# EAGLE design FDC_Board_DualSlim (EAGLE 7.5.0)
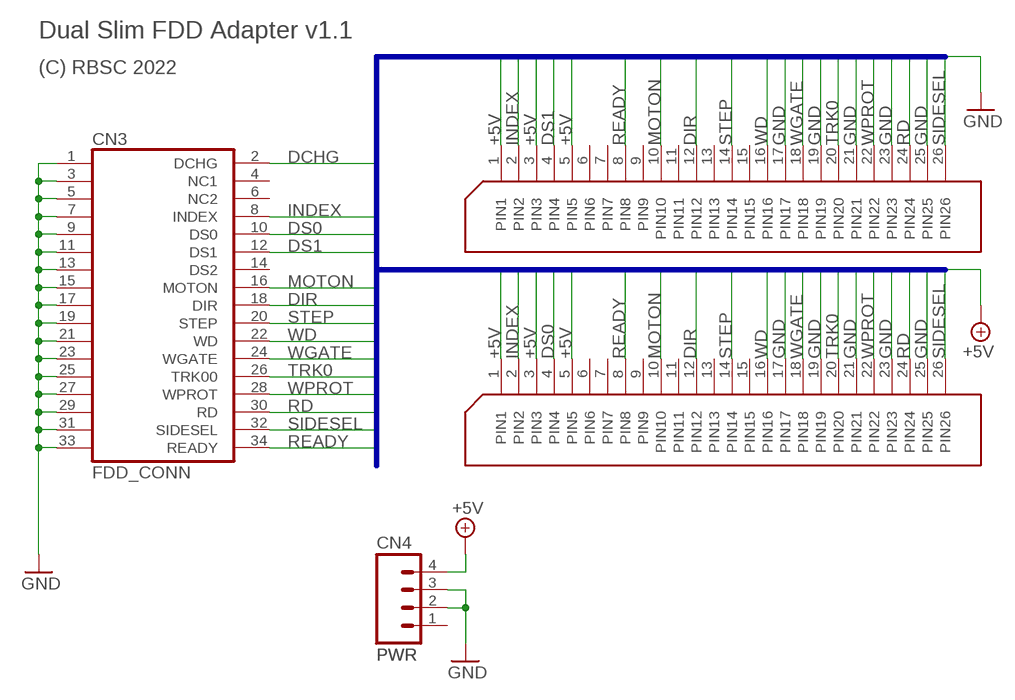
[diagram p0: schematic, sheet 1]

## Parts
CN1  FDC_26  [FDC26]
CN2  FDC_26  [FDC26]
CN3  FDD_CONN  [FDD_CONN]
CN4  PWR  M04LONGPADS  [1X04_LONGPADS]

## Nets
+5V: CN1.1(PIN1) CN1.3(PIN3) CN1.5(PIN5) CN2.1(PIN1) CN2.3(PIN3) CN2.5(PIN5) CN4.4
DCHG: CN3.2(DCHG)
DIR: CN1.12(PIN12) CN2.12(PIN12) CN3.18(DIR)
DS0: CN1.4(PIN4) CN3.10(DS0)
DS1: CN2.4(PIN4) CN3.12(DS1)
GND: CN1.17(PIN17) CN1.19(PIN19) CN1.21(PIN21) CN1.23(PIN23) CN1.25(PIN25) CN2.17(PIN17) CN2.19(PIN19) CN2.21(PIN21) CN2.23(PIN23) CN2.25(PIN25) CN3.1 CN3.3 CN3.5 CN3.7 CN3.9 CN3.11 CN3.13 CN3.15 CN3.17 CN3.19 CN3.21 CN3.23 CN3.25 CN3.27 CN3.29 CN3.31 CN3.33 CN4.2 CN4.3
INDEX: CN1.2(PIN2) CN2.2(PIN2) CN3.8(INDEX)
MOTON: CN1.10(PIN10) CN2.10(PIN10) CN3.16(MOTON)
RD: CN1.24(PIN24) CN2.24(PIN24) CN3.30(RD)
READY: CN1.8(PIN8) CN2.8(PIN8) CN3.34(READY)
SIDESEL: CN1.26(PIN26) CN2.26(PIN26) CN3.32(SIDESEL)
STEP: CN1.14(PIN14) CN2.14(PIN14) CN3.20(STEP)
TRK0: CN1.20(PIN20) CN2.20(PIN20) CN3.26(TRK00)
WD: CN1.16(PIN16) CN2.16(PIN16) CN3.22(WD)
WGATE: CN1.18(PIN18) CN2.18(PIN18) CN3.24(WGATE)
WPROT: CN1.22(PIN22) CN2.22(PIN22) CN3.28(WPROT)
Unconnected: CN1.6(PIN6) CN1.7(PIN7) CN1.9(PIN9) CN1.11(PIN11) CN1.13(PIN13) CN1.15(PIN15) CN2.6(PIN6) CN2.7(PIN7) CN2.9(PIN9) CN2.11(PIN11) CN2.13(PIN13) CN2.15(PIN15) CN3.4(NC1) CN3.6(NC2) CN3.14(DS2) CN4.1

## Buses
DCHG,INDEX,DS0,DS1,DS2,MOTON,DIR,STEP,WD,WGATE,TRK0,WPROT,RD,SIDESEL,READY,+5V,GND

## Notes on the sheet
- Dual Slim FDD Adapter v1.1
- (C) RBSC 2022
- PWR

## Library data of the parts
CN1 CN2 = fdc_26:FDC_26
CN3 = fdd_conn:FDD_CONN: Floppy interface old style
CN4 = SparkFun-Connectors:M04: Header 4 Standard 4-pin 0.1" header. Use with straight break away headers (SKU : PRT-00116), right angle break away headers (PRT-00553), swiss pins (PRT-00743), machine pins (PRT-00117), and female headers (PRT-00115). Molex polarized connector foot print use with SKU : PRT-08231 with associated crimp pins and housings. 1MM SMD Version SKU: PRT-10208

## Board
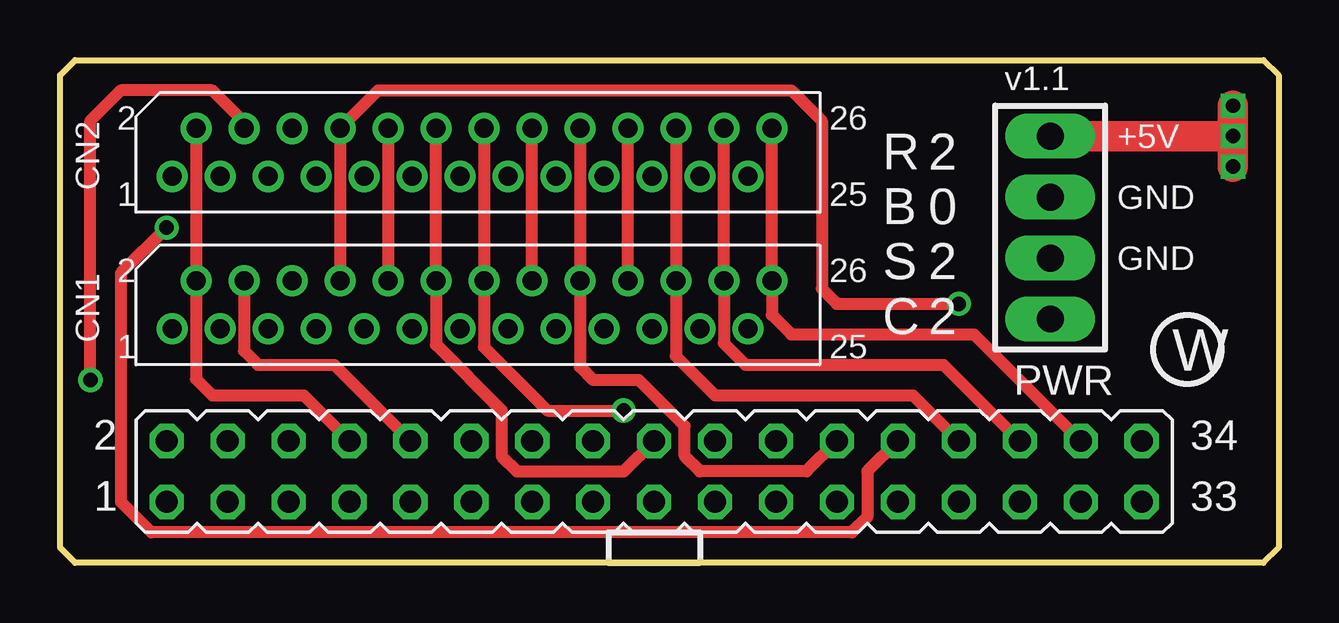
[diagram p1: board, top side]
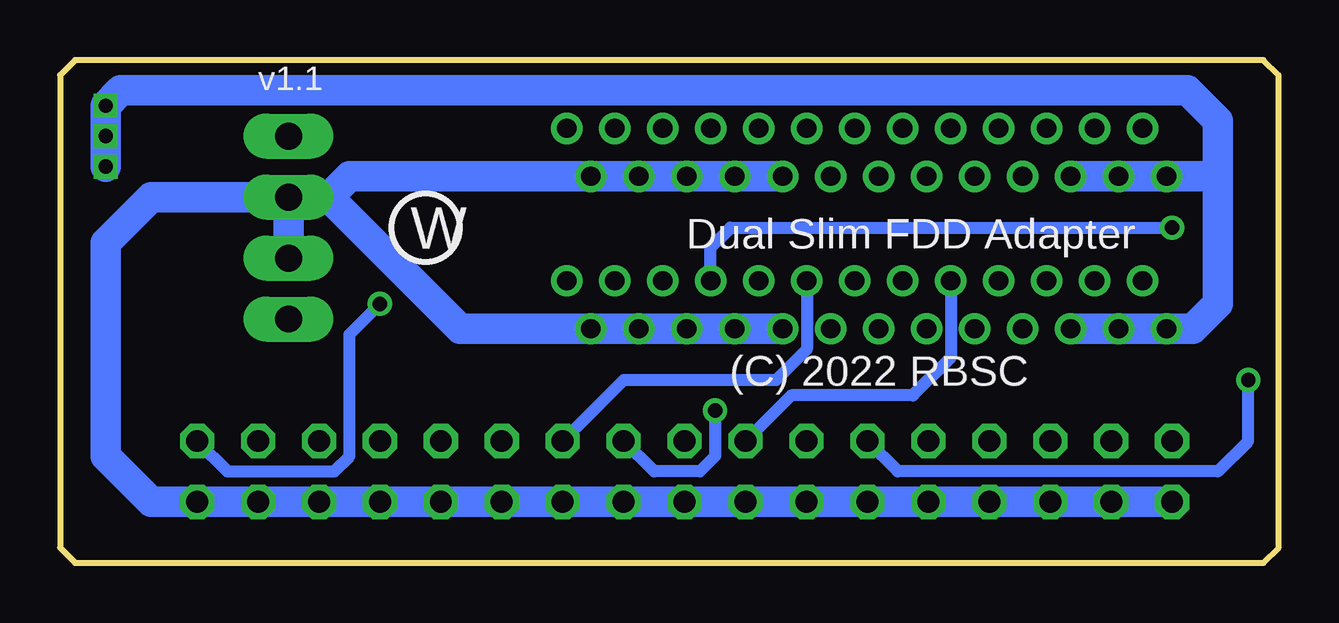
[diagram p2: board, bottom side, seen from below]

Size 50.8 x 20.95 mm. Coordinates in mm from the lower left corner, seen from the top.
Outline: 0,0.64 0,20.32 0.64,20.95 50.16,20.95 50.8,20.32 50.8,0.64 50.16,0 0.64,0 0,0.64
Copper layers (1*16): Top 0.035mm / dielectric 1.5mm / Bottom 0.035mm
Design rules "default *": minimum track width 10mil, minimum drill 24mil, track to track 8mil, track to pad 8mil, pad to pad 8mil, via to via 8mil, smd to smd 8mil, copper to edge 40mil, drill to drill 8mil, minimum pad ring 10mil, minimum via ring 8mil, stop-mask expansion 4mil, vias tented up to drill 24mil, thermal gap 10mil

### Footprints (pad centres in the part's own frame; a part is rotated, then mirrored left to right if it is on the bottom)
FDC26 = drill 0.8: 1 1.5,1.5; 2 2.5,3.5; 3 3.5,1.5; 4 4.5,3.5; 5 5.5,1.5; 6 6.5,3.5; 7 7.5,1.5; 8 8.5,3.5; 9 9.5,1.5; 10 10.5,3.5; 11 11.5,1.5; 12 12.5,3.5; 13 13.5,1.5; 14 14.5,3.5; 15 15.5,1.5; 16 16.5,3.5; 17 17.5,1.5; 18 18.5,3.5; 19 19.5,1.5; 20 20.5,3.5; 21 21.5,1.5; 22 22.5,3.5; 23 23.5,1.5; 24 24.5,3.5; 25 25.5,1.5; 26 26.5,3.5
FDD_CONN = drill 0.914 octagon: 1 -7.62,-1.27; 2 -7.62,1.27; 3 -5.08,-1.27; 4 -5.08,1.27; 5 -2.54,-1.27; 6 -2.54,1.27; 7 0,-1.27; 8 0,1.27; 9 2.54,-1.27; 10 2.54,1.27; 11 5.08,-1.27; 12 5.08,1.27; 13 7.62,-1.27; 14 7.62,1.27; 15 10.16,-1.27; 16 10.16,1.27; 17 12.7,-1.27; 18 12.7,1.27; 19 15.24,-1.27; 20 15.24,1.27; 21 17.78,-1.27; 22 17.78,1.27; 23 20.32,-1.27; 24 20.32,1.27; 25 22.86,-1.27; 26 22.86,1.27; 27 25.4,-1.27; 28 25.4,1.27; 29 27.94,-1.27; 30 27.94,1.27; 31 30.48,-1.27; 32 30.48,1.27; 33 33.02,-1.27; 34 33.02,1.27
1X04_LONGPADS = drill 1.118 pad 1.88 long: 1 0,0; 2 2.54,0; 3 5.08,0; 4 7.62,0

### Placement (x,y rotation side)
CN1  3.17,8.26 0 top
CN2  3.17,14.61 0 top
CN3  12.06,3.81 0 top
CN4  41.27,10.16 90 top

### Tracks (layer width: path | path; a pad name or v marks a point on that pad's centre or on a via)
+5V  (via drill 0.6)
  Top 1.27: CN4.4 v48.9,17.78 | v48.9,16.51 v48.9,17.78 | v48.9,19.05 v48.9,17.78
  Bottom 0.762: 2.77,16.11 2.54,15.88
  Bottom 1.27: CN1.5 CN1.3 CN1.1 3.58,9.76 2.54,10.79 2.54,15.88 2.54,18.41 3.81,19.68 48.26,19.68 v48.9,19.05 v48.9,17.78 v48.9,16.51 | CN2.5 CN2.3 CN2.1 2.77,16.11
DIR
  Top 0.508: CN2.12 CN1.12 15.68,9.09 18.41,6.35 18.41,4.45 19.05,3.81 23.5,3.81 CN3.18
DS0
  Top 0.508: CN3.10 11.43,8.26 8.26,8.26 7.67,8.84 CN1.4
DS1  (via drill 0.6)
  Top 0.508: CN2.4 7.67,18.36 6.35,19.68 2.54,19.68 1.27,18.41 v1.27,7.62
  Bottom 0.508: CN3.12 15.88,3.81 2.54,3.81 1.27,5.08 v1.27,7.62
GND
  Bottom 0.762: CN3.1 CN3.3 CN3.5 CN3.7 CN3.9 CN3.11 CN3.13 CN3.15 CN3.17 CN3.19 CN3.21 CN3.23 CN3.25 CN3.27 CN3.29 CN3.31 CN3.33 | CN2.23 CN2.25 | 26.9,16.11 26.67,15.88
  Bottom 1.27: CN4.3 46.99,15.24 48.9,13.34 48.9,4.45 46.99,2.54 CN3.33 CN3.1 | CN4.3 CN4.2 | CN2.17 CN2.19 CN2.21 CN2.23 | 26.9,16.11 CN2.25 38.73,16.11 39.6,15.24 | CN1.17 CN1.19 CN1.21 CN1.23 CN1.25 34.12,9.76 39.6,15.24 | CN4.3 39.6,15.24
INDEX
  Top 0.508: CN2.2 CN1.2 5.67,7.66 5.71,7.62 6.35,6.99 10.16,6.99 CN3.8
MOTON
  Top 0.508: CN2.10 CN1.10
  Bottom 0.508: CN1.10 13.68,8.55 15.24,6.99 20.32,6.99 CN3.16
RD
  Top 0.508: CN3.30 36.83,8.26 28.57,8.26 27.68,9.15 CN1.24 CN2.24
READY  (via drill 0.6)
  Top 0.508: CN1.8 CN2.8 13.26,19.68 30.48,19.68 31.75,18.41 31.75,11.43 32.38,10.79 v37.47,10.79
  Bottom 0.508: CN3.34 43.81,3.81 39.37,3.81 38.73,4.45 38.73,9.53 v37.47,10.79
SIDESEL
  Top 0.508: CN3.32 38.1,9.53 30.48,9.53 29.68,10.33 CN1.26 CN2.26
STEP  (via drill 0.6)
  Top 0.508: CN2.14 CN1.14 17.68,8.99 20.32,6.35 v23.5,6.35
  Bottom 0.508: v23.5,6.35 23.5,4.45 24.13,3.81 26.04,3.81 CN3.20
TRK0  (via drill 0.6)
  Top 0.508: CN3.26 33.66,3.81 33.66,1.91 33.02,1.27 3.81,1.27 2.54,2.54 2.54,12.06 v4.45,13.97 | CN1.20 CN2.20
  Bottom 0.508: CN1.20 23.68,13.15 22.86,13.97 v4.45,13.97
WD
  Top 0.508: CN1.16 CN2.16
  Bottom 0.508: CN1.16 19.68,8.9 20.95,7.62 27.3,7.62 CN3.22
WGATE
  Top 0.508: CN3.24 31.11,3.81 26.67,3.81 26.04,4.45 26.04,5.71 24.13,7.62 22.23,7.62 21.68,8.17 CN1.18 CN2.18
WPROT
  Top 0.508: CN3.28 35.56,6.99 27.3,6.99 25.68,8.62 CN1.22 CN2.22

### Text on the board
tNames: v1.1 | 2 | 26 | CN2 | +5V | 1 | 25 | GND | 2 | 26 | CN1 | GND | 1 | 25 | R / B / S / C | 2 / 0 / 2 / 2 | W | PWR
bNames: v1.1 | Dual Slim FDD Adapter | W | (C) 2022 RBSC